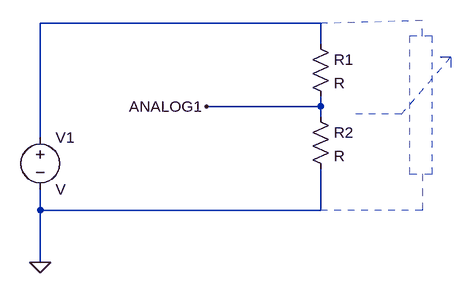
[diagram p0: schematic Potentiometer input.asc]
Potentiometer input.asc, the LTspice schematic file:
Version 4
SHEET 1 880 680
WIRE 576 128 144 128
WIRE 576 160 576 128
WIRE 576 256 576 240
WIRE 576 256 400 256
WIRE 576 272 576 256
WIRE 144 304 144 128
WIRE 144 416 144 384
WIRE 576 416 576 352
WIRE 576 416 144 416
WIRE 144 496 144 416
FLAG 144 496 0
FLAG 400 256 ANALOG1
SYMBOL voltage 144 288 R0
SYMATTR InstName V1
SYMBOL res 560 144 R0
SYMATTR InstName R1
SYMBOL res 560 256 R0
SYMATTR InstName R2
LINE Normal 700 268 776 180 2
LINE Normal 776 180 760 180 2
LINE Normal 760 180 776 180 2
LINE Normal 776 180 776 196 2
LINE Normal 700 268 620 268 2
LINE Normal 732 148 732 124 2
LINE Normal 732 124 576 128 2
LINE Normal 732 360 732 416 2
LINE Normal 732 416 576 416 2
RECTANGLE Normal 712 360 748 148 2

The netlist it stands for:
* Potentiometer input.asc
V1 N001 0 V
R1 N001 ANALOG1 R
R2 ANALOG1 0 R
.backanno
.end